# Altium project LimeSDR-USB_1v4.PrjPcb (part 6 of 8)

## Sheet 11_DDR2.SchDoc: RAM DDR2
size A3; Organization: Lime Microsystems; Address1: Surrey Tech Centre; Address2: Guildford GU2 7YG; Address3: Surray; Address4: United Kingdom; Revision: v1.4; SheetNumber: 11; SheetTotal: 15
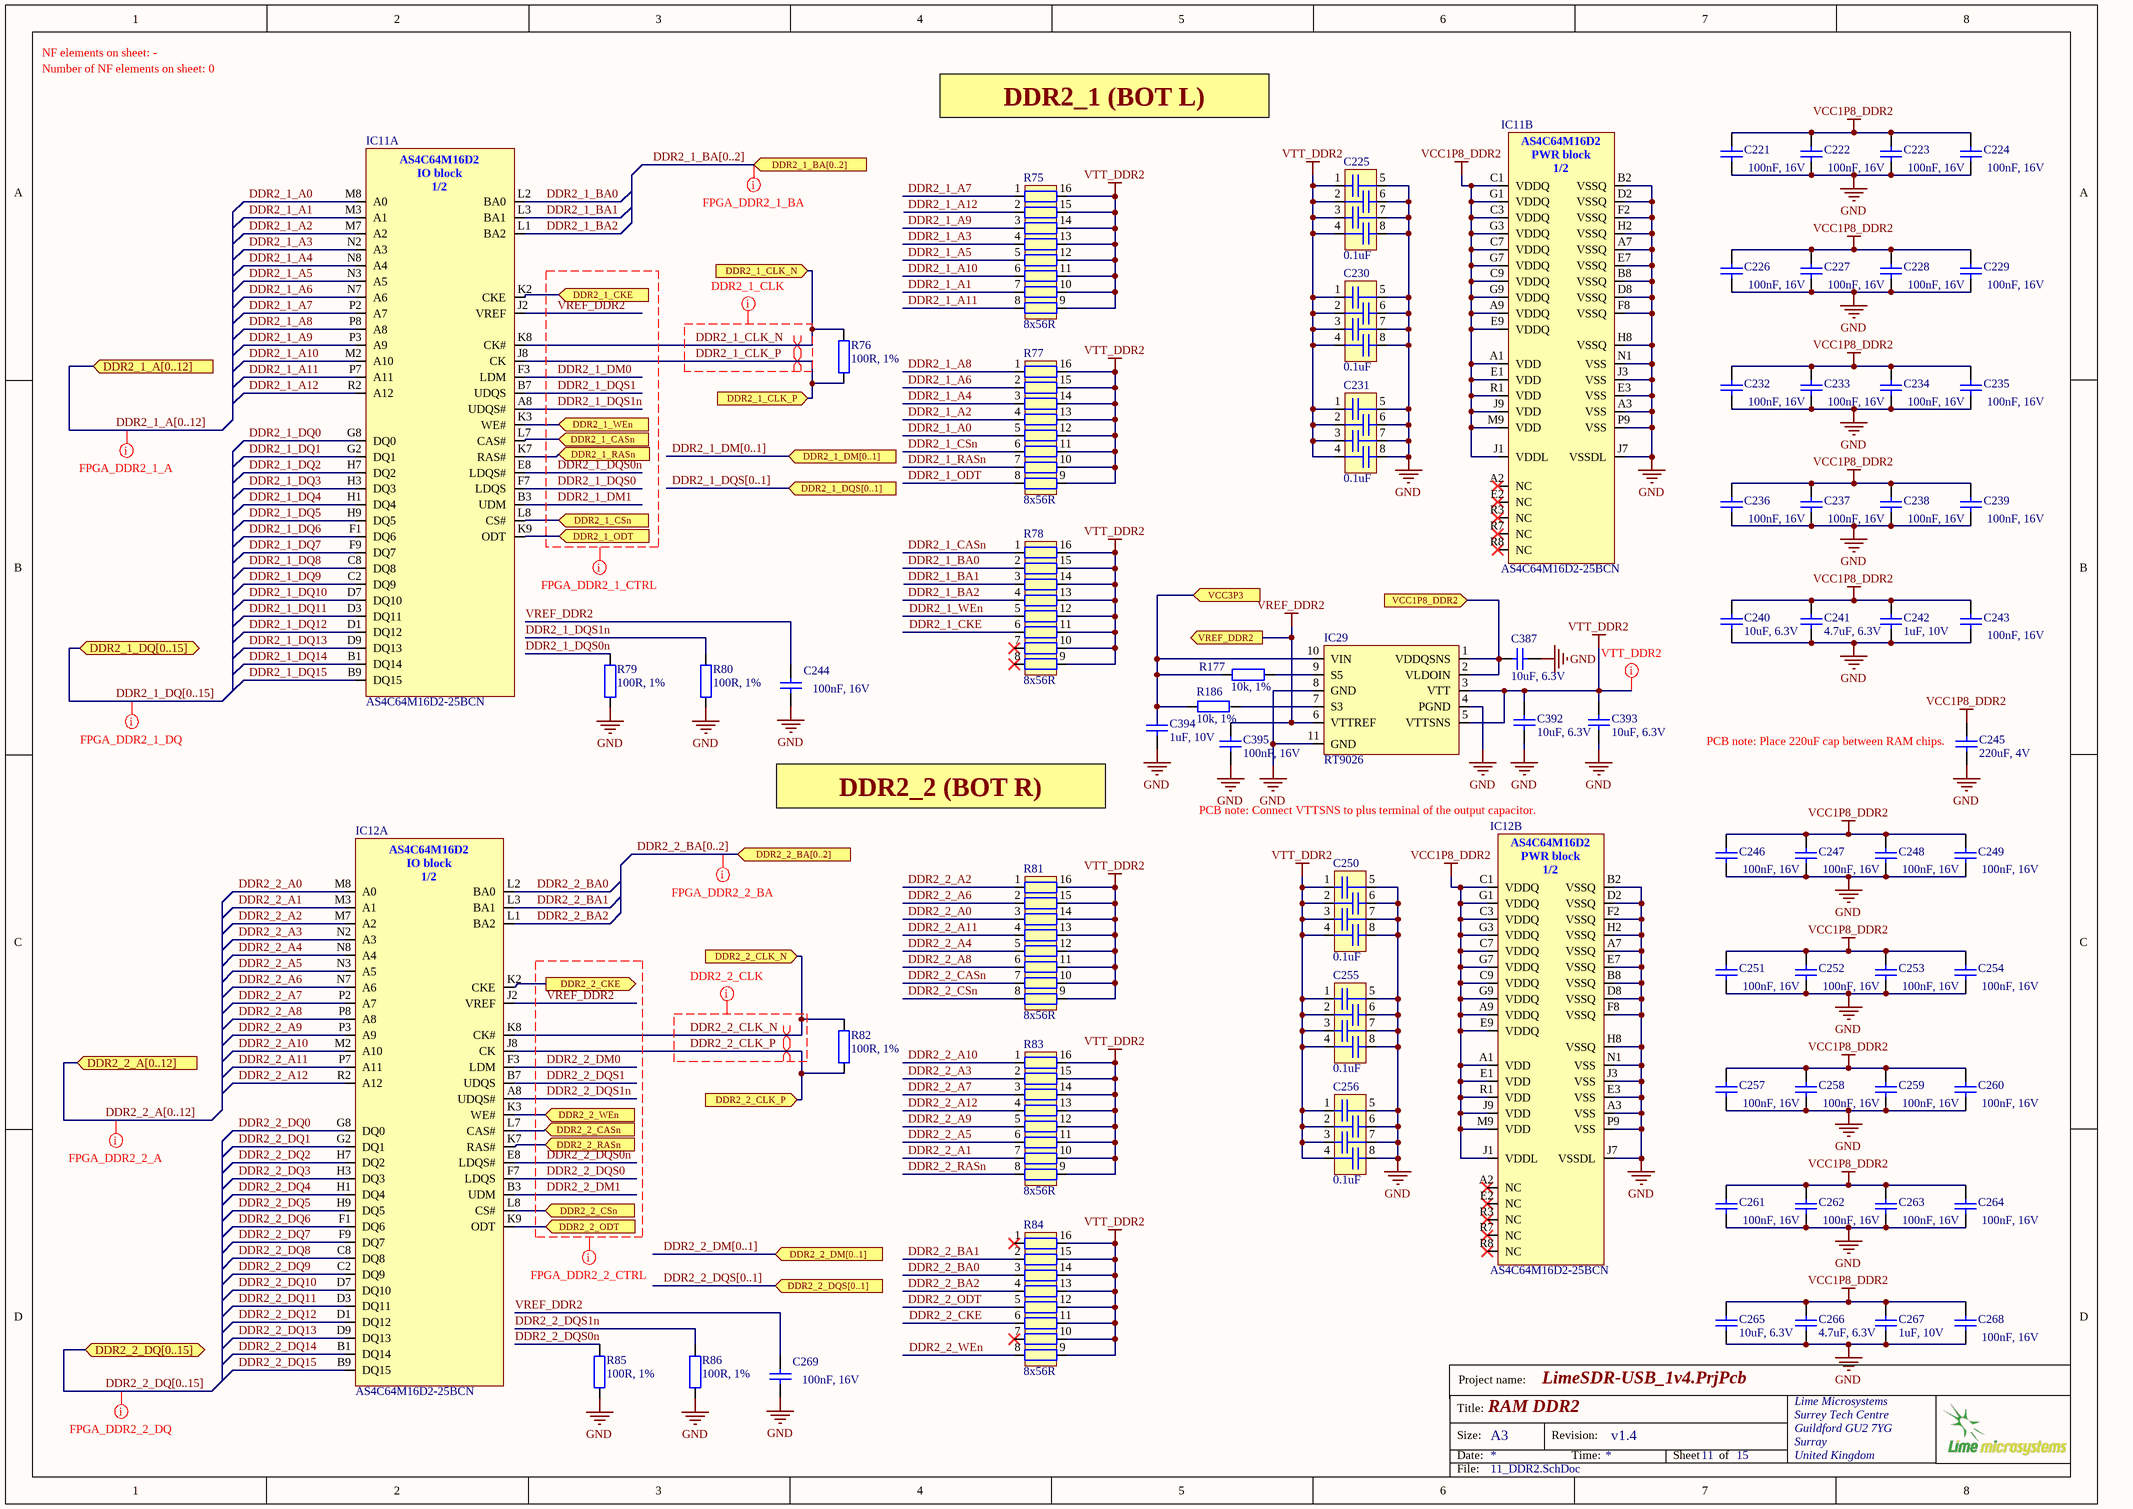
[diagram p10: 11_DDR2.SchDoc]

### Parts
C221  100nF, 16V  [CAP0402]
C222  100nF, 16V  [CAP0402]
C223  100nF, 16V  [CAP0402]
C224  100nF, 16V  [CAP0402]
C225  0.1uF  [CKCA43X7R1C104M100AA]
C226  100nF, 16V  [CAP0402]
C227  100nF, 16V  [CAP0402]
C228  100nF, 16V  [CAP0402]
C229  100nF, 16V  [CAP0402]
C230  0.1uF  [CKCA43X7R1C104M100AA]
C231  0.1uF  [CKCA43X7R1C104M100AA]
C232  100nF, 16V  [CAP0402]
C233  100nF, 16V  [CAP0402]
C234  100nF, 16V  [CAP0402]
C235  100nF, 16V  [CAP0402]
C236  100nF, 16V  [CAP0402]
C237  100nF, 16V  [CAP0402]
C238  100nF, 16V  [CAP0402]
C239  100nF, 16V  [CAP0402]
C240  10uF, 6.3V  [CAP0603]
C241  4.7uF, 6.3V  [CAP0402]
C242  1uF, 10V  [CAP0402]
C243  100nF, 16V  [CAP0402]
C244  100nF, 16V  [CAP0402]
C245  220uF, 4V  [CAP1206]
C246  100nF, 16V  [CAP0402]
C247  100nF, 16V  [CAP0402]
C248  100nF, 16V  [CAP0402]
C249  100nF, 16V  [CAP0402]
C250  0.1uF  [CKCA43X7R1C104M100AA]
C251  100nF, 16V  [CAP0402]
C252  100nF, 16V  [CAP0402]
C253  100nF, 16V  [CAP0402]
C254  100nF, 16V  [CAP0402]
C255  0.1uF  [CKCA43X7R1C104M100AA]
C256  0.1uF  [CKCA43X7R1C104M100AA]
C257  100nF, 16V  [CAP0402]
C258  100nF, 16V  [CAP0402]
C259  100nF, 16V  [CAP0402]
C260  100nF, 16V  [CAP0402]
C261  100nF, 16V  [CAP0402]
C262  100nF, 16V  [CAP0402]
C263  100nF, 16V  [CAP0402]
C264  100nF, 16V  [CAP0402]
C265  10uF, 6.3V  [CAP0603]
C266  4.7uF, 6.3V  [CAP0402]
C267  1uF, 10V  [CAP0402]
C268  100nF, 16V  [CAP0402]
C269  100nF, 16V  [CAP0402]
C387  10uF, 6.3V  [CAP0603]
C392  10uF, 6.3V  [CAP0603]
C393  10uF, 6.3V  [CAP0603]
C394  1uF, 10V  [CAP0402]
C395  100nF, 16V  [CAP0402]
IC11  AS4C64M16D2-25BCN  [AS4C64M16D2]  (parts A,B of 2)
IC12  AS4C64M16D2-25BCN  [AS4C64M16D2]  (parts A,B of 2)
IC29  RT9026  [MSOP10]
R75  8x56R  [EXB2HV]
R76  100R, 1%  [RES0402]
R77  8x56R  [EXB2HV]
R78  8x56R  [EXB2HV]
R79  100R, 1%  [RES0402]
R80  100R, 1%  [RES0402]
R81  8x56R  [EXB2HV]
R82  100R, 1%  [RES0402]
R83  8x56R  [EXB2HV]
R84  8x56R  [EXB2HV]
R85  100R, 1%  [RES0402]
R86  100R, 1%  [RES0402]
R177  10k, 1%  [RES0402]
R186  10k, 1%  [RES0402]

### Ports
DDR2_1_A[0..12] (in), DDR2_1_BA[0..2] (in), DDR2_1_CASn (in), DDR2_1_CKE (in), DDR2_1_CLK_N (in), DDR2_1_CLK_P (in), DDR2_1_CSn (in), DDR2_1_DM[0..1] (in), DDR2_1_DQ[0..15] (bidir), DDR2_1_DQS[0..1] (in), DDR2_1_ODT (in), DDR2_1_RASn (in), DDR2_1_WEn (in), DDR2_2_A[0..12] (in), DDR2_2_BA[0..2] (in), DDR2_2_CASn (in), DDR2_2_CKE (out), DDR2_2_CLK_N (in), DDR2_2_CLK_P (in), DDR2_2_CSn (in), DDR2_2_DM[0..1] (in), DDR2_2_DQ[0..15] (bidir), DDR2_2_DQS[0..1] (in), DDR2_2_ODT (in), DDR2_2_RASn (in), DDR2_2_WEn (in), VCC1P8_DDR2 (in), VCC3P3 (in), VREF_DDR2 (out)

### Nets
GND: C221.2 C222.2 C223.2 C224.2 C225.5 C225.6 C225.7 C225.8 C226.2 C227.2 C228.2 C229.2 C230.5 C230.6 C230.7 C230.8 C231.5 C231.6 C231.7 C231.8 C232.2 C233.2 C234.2 C235.2 C236.2 C237.2 C238.2 C239.2 C240.1 C241.1 C242.1 C243.2 C244.2 C245.1 C246.2 C247.2 C248.2 C249.2 C250.5 C250.6 C250.7 C250.8 C251.2 C252.2 C253.2 C254.2 C255.5 C255.6 C255.7 C255.8 C256.5 C256.6 C256.7 C256.8 C257.2 C258.2 C259.2 C260.2 C261.2 C262.2 C263.2 C264.2 C265.1 C266.1 C267.1 C268.2 C269.2 C387.1 C392.1 C393.1 C394.1 C395.2 IC11.A3(VSS) IC11.A7(VSSQ) IC11.B2(VSSQ) IC11.B8(VSSQ) IC11.D2(VSSQ) IC11.D8(VSSQ) IC11.E3(VSS) IC11.E7(VSSQ) IC11.F2(VSSQ) IC11.F8(VSSQ) IC11.H2(VSSQ) IC11.H8(VSSQ) IC11.J3(VSS) IC11.J7(VSSDL) IC11.N1(VSS) IC11.P9(VSS) IC12.A3(VSS) IC12.A7(VSSQ) IC12.B2(VSSQ) IC12.B8(VSSQ) IC12.D2(VSSQ) IC12.D8(VSSQ) IC12.E3(VSS) IC12.E7(VSSQ) IC12.F2(VSSQ) IC12.F8(VSSQ) IC12.H2(VSSQ) IC12.H8(VSSQ) IC12.J3(VSS) IC12.J7(VSSDL) IC12.N1(VSS) IC12.P9(VSS) IC29.4(PGND) IC29.8(GND) IC29.11(GND) R79.1 R80.1 R85.1 R86.1
VCC1P8_DDR2: C221.1 C222.1 C223.1 C224.1 C226.1 C227.1 C228.1 C229.1 C232.1 C233.1 C234.1 C235.1 C236.1 C237.1 C238.1 C239.1 C240.2 C241.2 C242.2 C243.1 C245.2 C246.1 C247.1 C248.1 C249.1 C251.1 C252.1 C253.1 C254.1 C257.1 C258.1 C259.1 C260.1 C261.1 C262.1 C263.1 C264.1 C265.2 C266.2 C267.2 C268.1 IC11.A1(VDD) IC11.A9(VDDQ) IC11.C1(VDDQ) IC11.C3(VDDQ) IC11.C7(VDDQ) IC11.C9(VDDQ) IC11.E1(VDD) IC11.E9(VDDQ) IC11.G1(VDDQ) IC11.G3(VDDQ) IC11.G7(VDDQ) IC11.G9(VDDQ) IC11.J1(VDDL) IC11.J9(VDD) IC11.M9(VDD) IC11.R1(VDD) IC12.A1(VDD) IC12.A9(VDDQ) IC12.C1(VDDQ) IC12.C3(VDDQ) IC12.C7(VDDQ) IC12.C9(VDDQ) IC12.E1(VDD) IC12.E9(VDDQ) IC12.G1(VDDQ) IC12.G3(VDDQ) IC12.G7(VDDQ) IC12.G9(VDDQ) IC12.J1(VDDL) IC12.J9(VDD) IC12.M9(VDD) IC12.R1(VDD)
VCC_P3: C394.2 IC29.10(VIN) R177.1 R186.1 ; port VCC3P3
VREF_DDR2: C244.1 C269.1 C395.1 IC11.J2(VREF) IC12.J2(VREF) IC29.6(VTTREF) ; port VREF_DDR2
VTT_DDR2: C225.1 C225.2 C225.3 C225.4 C230.1 C230.2 C230.3 C230.4 C231.1 C231.2 C231.3 C231.4 C250.1 C250.2 C250.3 C250.4 C255.1 C255.2 C255.3 C255.4 C256.1 C256.2 C256.3 C256.4 C392.2 C393.2 IC29.3(VTT) IC29.5(VTTSNS) R75.9 R75.10 R75.11 R75.12 R75.13 R75.14 R75.15 R75.16 R77.9 R77.10 R77.11 R77.12 R77.13 R77.14 R77.15 R77.16 R78.9 R78.10 R78.11 R78.12 R78.13 R78.14 R78.15 R78.16 R81.9 R81.10 R81.11 R81.12 R81.13 R81.14 R81.15 R81.16 R83.9 R83.10 R83.11 R83.12 R83.13 R83.14 R83.15 R83.16 R84.9 R84.10 R84.11 R84.12 R84.13 R84.14 R84.15 R84.16
DDR2_1_A0: IC11.M8(A0) R77.5
DDR2_1_A1: IC11.M3(A1) R75.7
DDR2_1_A2: IC11.M7(A2) R77.4
DDR2_1_A3: IC11.N2(A3) R75.4
DDR2_1_A4: IC11.N8(A4) R77.3
DDR2_1_A5: IC11.N3(A5) R75.5
DDR2_1_A6: IC11.N7(A6) R77.2
DDR2_1_A7: IC11.P2(A7) R75.1
DDR2_1_A8: IC11.P8(A8) R77.1
DDR2_1_A9: IC11.P3(A9) R75.3
DDR2_1_A10: IC11.M2(A10) R75.6
DDR2_1_A11: IC11.P7(A11) R75.8
DDR2_1_A12: IC11.R2(A12) R75.2
DDR2_1_BA0: IC11.L2(BA0) R78.2
DDR2_1_BA1: IC11.L3(BA1) R78.3
DDR2_1_BA2: IC11.L1(BA2) R78.4
DDR2_1_CASn: R78.1
DDR2_1_CKE: R78.6
DDR2_1_CLK_N: IC11.K8(CK#) R76.2 ; port DDR2_1_CLK_N
DDR2_1_CLK_P: IC11.J8(CK) R76.1 ; port DDR2_1_CLK_P
DDR2_1_CSn: R77.6
DDR2_1_CTL0: IC11.K2(CKE) ; port DDR2_1_CKE
DDR2_1_CTL1: IC11.K9(ODT) ; port DDR2_1_ODT
DDR2_1_CTL2: IC11.K7(RAS#) ; port DDR2_1_RASn
DDR2_1_CTL3: IC11.L7(CAS#) ; port DDR2_1_CASn
DDR2_1_CTL4: IC11.L8(CS#) ; port DDR2_1_CSn
DDR2_1_CTL5: IC11.K3(WE#) ; port DDR2_1_WEn
DDR2_1_DM0: IC11.F3(LDM)
DDR2_1_DM1: IC11.B3(UDM)
DDR2_1_DQ0: IC11.G8(DQ0)
DDR2_1_DQ1: IC11.G2(DQ1)
DDR2_1_DQ2: IC11.H7(DQ2)
DDR2_1_DQ3: IC11.H3(DQ3)
DDR2_1_DQ4: IC11.H1(DQ4)
DDR2_1_DQ5: IC11.H9(DQ5)
DDR2_1_DQ6: IC11.F1(DQ6)
DDR2_1_DQ7: IC11.F9(DQ7)
DDR2_1_DQ8: IC11.C8(DQ8)
DDR2_1_DQ9: IC11.C2(DQ9)
DDR2_1_DQ10: IC11.D7(DQ10)
DDR2_1_DQ11: IC11.D3(DQ11)
DDR2_1_DQ12: IC11.D1(DQ12)
DDR2_1_DQ13: IC11.D9(DQ13)
DDR2_1_DQ14: IC11.B1(DQ14)
DDR2_1_DQ15: IC11.B9(DQ15)
DDR2_1_DQS0: IC11.F7(LDQS)
DDR2_1_DQS0n: IC11.E8(LDQS#) R79.2
DDR2_1_DQS1: IC11.B7(UDQS)
DDR2_1_DQS1n: IC11.A8(UDQS#) R80.2
DDR2_1_ODT: R77.8
DDR2_1_RASn: R77.7
DDR2_1_WEn: R78.5
DDR2_2_A0: IC12.M8(A0) R81.3
DDR2_2_A1: IC12.M3(A1) R83.7
DDR2_2_A2: IC12.M7(A2) R81.1
DDR2_2_A3: IC12.N2(A3) R83.2
DDR2_2_A4: IC12.N8(A4) R81.5
DDR2_2_A5: IC12.N3(A5) R83.6
DDR2_2_A6: IC12.N7(A6) R81.2
DDR2_2_A7: IC12.P2(A7) R83.3
DDR2_2_A8: IC12.P8(A8) R81.6
DDR2_2_A9: IC12.P3(A9) R83.5
DDR2_2_A10: IC12.M2(A10) R83.1
DDR2_2_A11: IC12.P7(A11) R81.4
DDR2_2_A12: IC12.R2(A12) R83.4
DDR2_2_BA0: IC12.L2(BA0) R84.3
DDR2_2_BA1: IC12.L3(BA1) R84.2
DDR2_2_BA2: IC12.L1(BA2) R84.4
DDR2_2_CASn: R81.7
DDR2_2_CKE: R84.6
DDR2_2_CLK_N: IC12.K8(CK#) R82.2 ; port DDR2_2_CLK_N
DDR2_2_CLK_P: IC12.J8(CK) R82.1 ; port DDR2_2_CLK_P
DDR2_2_CSn: R81.8
DDR2_2_CTL0: IC12.K2(CKE) ; port DDR2_2_CKE
DDR2_2_CTL1: IC12.K9(ODT) ; port DDR2_2_ODT
DDR2_2_CTL2: IC12.K7(RAS#) ; port DDR2_2_RASn
DDR2_2_CTL3: IC12.L7(CAS#) ; port DDR2_2_CASn
DDR2_2_CTL4: IC12.L8(CS#) ; port DDR2_2_CSn
DDR2_2_CTL5: IC12.K3(WE#) ; port DDR2_2_WEn
DDR2_2_DM0: IC12.F3(LDM)
DDR2_2_DM1: IC12.B3(UDM)
DDR2_2_DQ0: IC12.G8(DQ0)
DDR2_2_DQ1: IC12.G2(DQ1)
DDR2_2_DQ2: IC12.H7(DQ2)
DDR2_2_DQ3: IC12.H3(DQ3)
DDR2_2_DQ4: IC12.H1(DQ4)
DDR2_2_DQ5: IC12.H9(DQ5)
DDR2_2_DQ6: IC12.F1(DQ6)
DDR2_2_DQ7: IC12.F9(DQ7)
DDR2_2_DQ8: IC12.C8(DQ8)
DDR2_2_DQ9: IC12.C2(DQ9)
DDR2_2_DQ10: IC12.D7(DQ10)
DDR2_2_DQ11: IC12.D3(DQ11)
DDR2_2_DQ12: IC12.D1(DQ12)
DDR2_2_DQ13: IC12.D9(DQ13)
DDR2_2_DQ14: IC12.B1(DQ14)
DDR2_2_DQ15: IC12.B9(DQ15)
DDR2_2_DQS0: IC12.F7(LDQS)
DDR2_2_DQS0n: IC12.E8(LDQS#) R85.2
DDR2_2_DQS1: IC12.B7(UDQS)
DDR2_2_DQS1n: IC12.A8(UDQS#) R86.2
DDR2_2_ODT: R84.5
DDR2_2_RASn: R83.8
DDR2_2_WEn: R84.8
VCC_P4: C387.2 IC29.1(VDDQSNS) IC29.2(VLDOIN) ; port VCC1P8_DDR2
NetIC29_7: IC29.7(S3) R186.2
NetIC29_9: IC29.9(S5) R177.2

Not connected (* = marked no-connect by the designer): IC11 A2(NC)* E2(NC)* R3(NC)* R7(NC)* R8(NC)*; IC12 A2(NC)* E2(NC)* R3(NC)* R7(NC)* R8(NC)*; R78 7* 8*; R84 1* 7*

### Buses and harness runs
bus DDR2_1_A[0..12] = port DDR2_1_A[0..12]
bus DDR2_1_BA[0..2] = port DDR2_1_BA[0..2]
bus DDR2_1_DM[0..1] = port DDR2_1_DM[0..1]
bus DDR2_1_DQ[0..15] = port DDR2_1_DQ[0..15]
bus DDR2_1_DQS[0..1] = port DDR2_1_DQS[0..1]
bus DDR2_2_A[0..12] = port DDR2_2_A[0..12]
bus DDR2_2_BA[0..2] = port DDR2_2_BA[0..2]
bus DDR2_2_DM[0..1] = port DDR2_2_DM[0..1]
bus DDR2_2_DQ[0..15] = port DDR2_2_DQ[0..15]
bus DDR2_2_DQS[0..1] = port DDR2_2_DQS[0..1]

### Layout directives
net class FPGA_DDR0_DQ: (no net found under the mark)
net class FPGA_DDR0_BA: (no net found under the mark)
net class FPGA_DDR0_CTRL: DDR2_1_DM0, DDR2_1_DM1, DDR2_1_DQS0, DDR2_1_DQS0n, DDR2_1_DQS1, DDR2_1_DQS1n, VREF_DDR2
net class FPGA_DDR0_A: (no net found under the mark)
net class FPGA_DDR1_DQ: (no net found under the mark)
net class FPGA_DDR1_BA: (no net found under the mark)
net class FPGA_DDR1_CTRL: DDR2_2_DM0, DDR2_2_DM1, DDR2_2_DQS0, DDR2_2_DQS0n, DDR2_2_DQS1, DDR2_2_DQS1n, VREF_DDR2
net class FPGA_DDR1_A: (no net found under the mark)
differential pair: DDR2_1_CLK_N, DDR2_1_CLK_P, DDR2_2_CLK_N, DDR2_2_CLK_P
net class DDR2_1_CK: DDR2_1_CLK_N, DDR2_1_CLK_P, DDR2_2_CLK_N, DDR2_2_CLK_P
net class VTT_DDR2: VTT_DDR2

### Notes on the sheet
- Number of NF elements on sheet: 0
- NF elements on sheet: -
- DDR2_1 (BOT L)
- (near C245) PCB note: Place 220uF cap between RAM chips.
- DDR2_2 (BOT R)
- PCB note: Connect VTTSNS to plus terminal of the output capacitor.
- Project name:
- Title:
- Size:
- Date:
- A3
- Revision:
- Time:
- Sheet
- of
- File:
- (in symbol AS4C64M16D2-25BCN, part A) AS4C64M16D2 / IO block / 1/2
- (in symbol AS4C64M16D2-25BCN, part B) AS4C64M16D2 / PWR block / 1/2

### Library data of the parts
C221-C224 C226-C229 C232-C239 C243 C244 C246-C249 C251-C254 C257-C264 C268 C269 = Cap_0603: as C103-C114 on sheet 08_FPGA_banks_1_2_3_4; Supplier 1: Mouser; Supplier Part Number 1: 81-GRM155R71C104KA88; Case Code - in: 0402; Manufacturer: Murata Electronics; Category: Multilayer Ceramic Capacitors MLCC - SMD/SMT; Voltage Rating DC: 16 V; Value: 100nF, 16V; Manufacturer Part Number: GRM155R71C104KA88D
C225 C230 C231 C250 C255 C256 = 4X_cap_array_1206: Manufacturer: TDK; Part Description: CAP ARRAY 0.1UF 16V X7R 1206; Case Height: 1 mm; Case Length: 3.2 mm; Case Width: 1.6 mm; Voltage Rating: 16 V; Number of Elements: 4; Tolerance: 20 %; Temperature Coefficient / Code: X7R; Value: 0.1uF; Supplier 1: Mouser; Supplier Part Number 1: 810-CKCA43X7R1C104M; RoHS: RoHS Compliant; Termination Style: SMD/SMT; Brand: TDK; Category: Capacitor Arrays & Networks; Product: Ceramic Capacitor Arrays; Series: CKC; Packaging: Reel; Operating Temperature Range: - 55 C to + 125 C; Manufacturer Part Number 1: CKCA43X7R1C104M100AA; Capacitance: 0.1 uF; Product Category: Capacitor Arrays; Standard Pack Qty: 2000; RoHS - Mouser: Y; Minimum Order Quantity: 1; Reeling: True
C240 C265 C387 C392 C393 = Cap_0603: as C116 on sheet 10_FPGA_misc; Supplier 1: Digi-Key; Supplier Part Number 1: 311-1448-2-ND; Package / Case: 0603 (1608 Metric); Category: Capacitors; Voltage - Rated: 6.3V; Value: 10uF, 6.3V
C241 C266 = Cap_0402: as C117 on sheet 10_FPGA_misc; Lead Style: -; Ratings: -; Height - Seated (Max): -; Thickness (Max): 0.022" (0.55mm); Voltage - Rated: 6.3V; Packaging: Cut Tape (CT); Lead Spacing: -; Category: Capacitors; Supplier Part Number 1: 490-5408-1-ND; Applications: General Purpose; Operating Temperature: -55°C ~ 85°C; Mounting Type: Surface Mount, MLCC; Features: Derating Recommended; RoHS: RoHS Compliant; Supplier 1: Digi-Key; Package / Case: 0402 (1005 Metric); Size / Dimension: 0.039" L x 0.020" W (1.00mm x 0.50mm); Value: 4.7uF, 6.3V
C242 C267 C394 = Cap_0402: as C118 on sheet 10_FPGA_misc; Value: 1uF, 10V; Supplier 1: Newark; Supplier Part Number 1: 490-6298-2-ND; MSL: -; RoHS: YES
C245 = Cap_1206: as C115 on sheet 10_FPGA_misc; Package / Case: 1206 (3216 Metric); Supplier 1: Digi-Key; Packaging: Cut Tape (CT); Size / Dimension: 0.126" L x 0.063" W (3.20mm x 1.60mm); Operating Temperature: -55°C ~ 85°C; Voltage - Rated: 4V; Mounting Type: Surface Mount, MLCC; Ratings: -; Supplier Part Number 1: 490-9774-1-ND; Category: Capacitors; Lead Spacing: -; Lead Style: -; Applications: General Purpose; Features: -; Height - Seated (Max): -; Thickness (Max): 0.075" (1.90mm); RoHS: RoHS Compliant; Value: 220uF, 4V; Manufacturer Part Number 1: GRM31CR60G227ME11L
C395 = Cap_0402: Manufacturer: Murata Electronics; Manufacturer Part Number: GRM155R71C104KA88D; Part Description: 0.10µF ±10% 16V X7R Ceramic Capacitor -55°C ~ 125°C Surface Mount, MLCC 0402 (1005 Metric) 0.039" L x 0.020" W (1.00mm x 0.50mm); Tolerance: 10 %; Type: General Purpose MLCC; Capacitance: 0.1 uF; Case Length: 1 mm; Dielectric: X7R; Case Height: 0.5 mm; Temperature Coefficient / Code: +/- 15 %; Value: 100nF, 16V; Supplier 1: Mouser; Supplier Part Number 1: 81-GRM155R71C104KA88; Case Code - in: 0402; RoHS: RoHS Compliant; Operating Temperature Range: - 55 C to + 125 C; Series: GRM; Termination Style: SMD/SMT; Package / Case: 0402 (1005 metric); Voltage Rating DC: 16 V; Maximum Operating Temperature: + 125 C; Case Code - mm: 1005; Minimum Operating Temperature: - 55 C; Product Category: Low & Medium Capacitance SMD Ceramic Chip Capacitors; Packaging: Reel; Product: General Type MLCCs; Category: Multilayer Ceramic Capacitors MLCC - SMD/SMT; Brand: Murata Electronics; Case Width: 0.5 mm; RoHS - Mouser: Y; Standard Pack Qty: 10000; Minimum Order Quantity: 1; Reeling: True; Manufacturer Part Number 1: GRM155R71C104KA88D
IC11 IC12 = AS4C64M16D2-25BCN: Manufacturer: Alliance Memory, Inc.; Part Description: IC SDRAM 64MX16 1.8V 84-FBGA; Speed: 400MHz; Interface: Parallel; Memory Type: DDR2 SDRAM; Memory Size: 1G (64M x 16); Voltage - Supply: 1.7 V ~ 1.9 V; Format - Memory: RAM; Supplier 1: Digi-Key; Package / Case: 84-TFBGA; Supplier Device Package: 84-FBGA (8x12.5); Manufacturer Part Number 1: AS4C64M16D2-25BCN; RoHS: RoHS Compliant; Operating Temperature: 0°C ~ 70°C; Category: Integrated Circuits (ICs); Packaging: Tray; Supplier Part Number 1: 1450-1158-ND
IC29 = RT9026: Manufacturer Part Number 1: RT9026GFP; Manufacturer: Richtek USA Inc.; Part Description: IC DDR TERMINATION REG 10MSOP; Number of Outputs: 1; Voltage - Input: 3.15 V ~ 5.5 V; Supplier 1: Digi-Key; Supplier Part Number 1: 1028-1010-1-ND; Supplier Device Package: 10-MSOP-EP; Operating Temperature: -40°C ~ 85°C; Applications: Converter, DDR Bus Termination Regulator; RoHS: RoHS Compliant; Packaging: Cut Tape (CT); Mounting Type: Surface Mount; Package / Case: 10-TFSOP, 10-MSOP (0.118", 3.00mm Width) Exposed Pad; Category: Integrated Circuits (ICs)
R75 R77 R78 R81 R83 R84 = 8X_resistor_array_0402: Manufacturer Part Number 1: EXB2HV560JV; Manufacturer: PANASONIC ELECTRONIC COMPONENTS; Part Description: RES ARRAY 8 RES 56 OHM 1506; Supplier 1: Farnell; Supplier Part Number 1: 2060070; RoHS: YES
R76 R79 R80 R82 R85 R86 = Res_0402: Manufacturer Part Number 1: RMCF0402FT100R; Part Description: RES SMD 100 OHM 1% 1/16W 0402; Manufacturer: Stackpole Electronics Inc.; Temperature Coefficient: ±100ppm/°C; Supplier 1: Digi-Key; Supplier Part Number 1: RMCF0402FT100RDKR-ND; Package / Case: 0402 (1005 Metric); Composition: Thick Film; Category: Resistors; Tolerance: ±1%; Value: 100R, 1%
R177 R186 = Res_0402: as R55 on sheet 10_FPGA_misc; Value: 10k, 1%; Supplier 1: Digi-Key; Supplier Part Number 1: 311-10.0KLRTR-ND; Resistance (Ohms): 10k; Packaging: Tape & Reel (TR); RoHS: RoHS Compliant; Package / Case: 0402 (1005 Metric); Tolerance: ±1%; Operating Temperature: -55°C ~ 155°C; Size / Dimension: 0.039" L x 0.020" W (1.00mm x 0.50mm); Number of Terminations: 2; Category: Resistors; Height: 0.016" (0.40mm); Supplier Device Package: 0402; Features: Moisture Resistant; Composition: Thick Film

## Sheet LMS7002M.SchDoc: LMS7002M Sheet Symbol Connections
size A3; Author: NeoExiZ; CompanyName: BUPT CPS Lab; Engineer: NeoExiZ; Organization: NeoExiZ; Address1: 418, 4#Building,BUPT; Address2: No.10, Xitucheng Road; Address3: Beijing; Address4: China
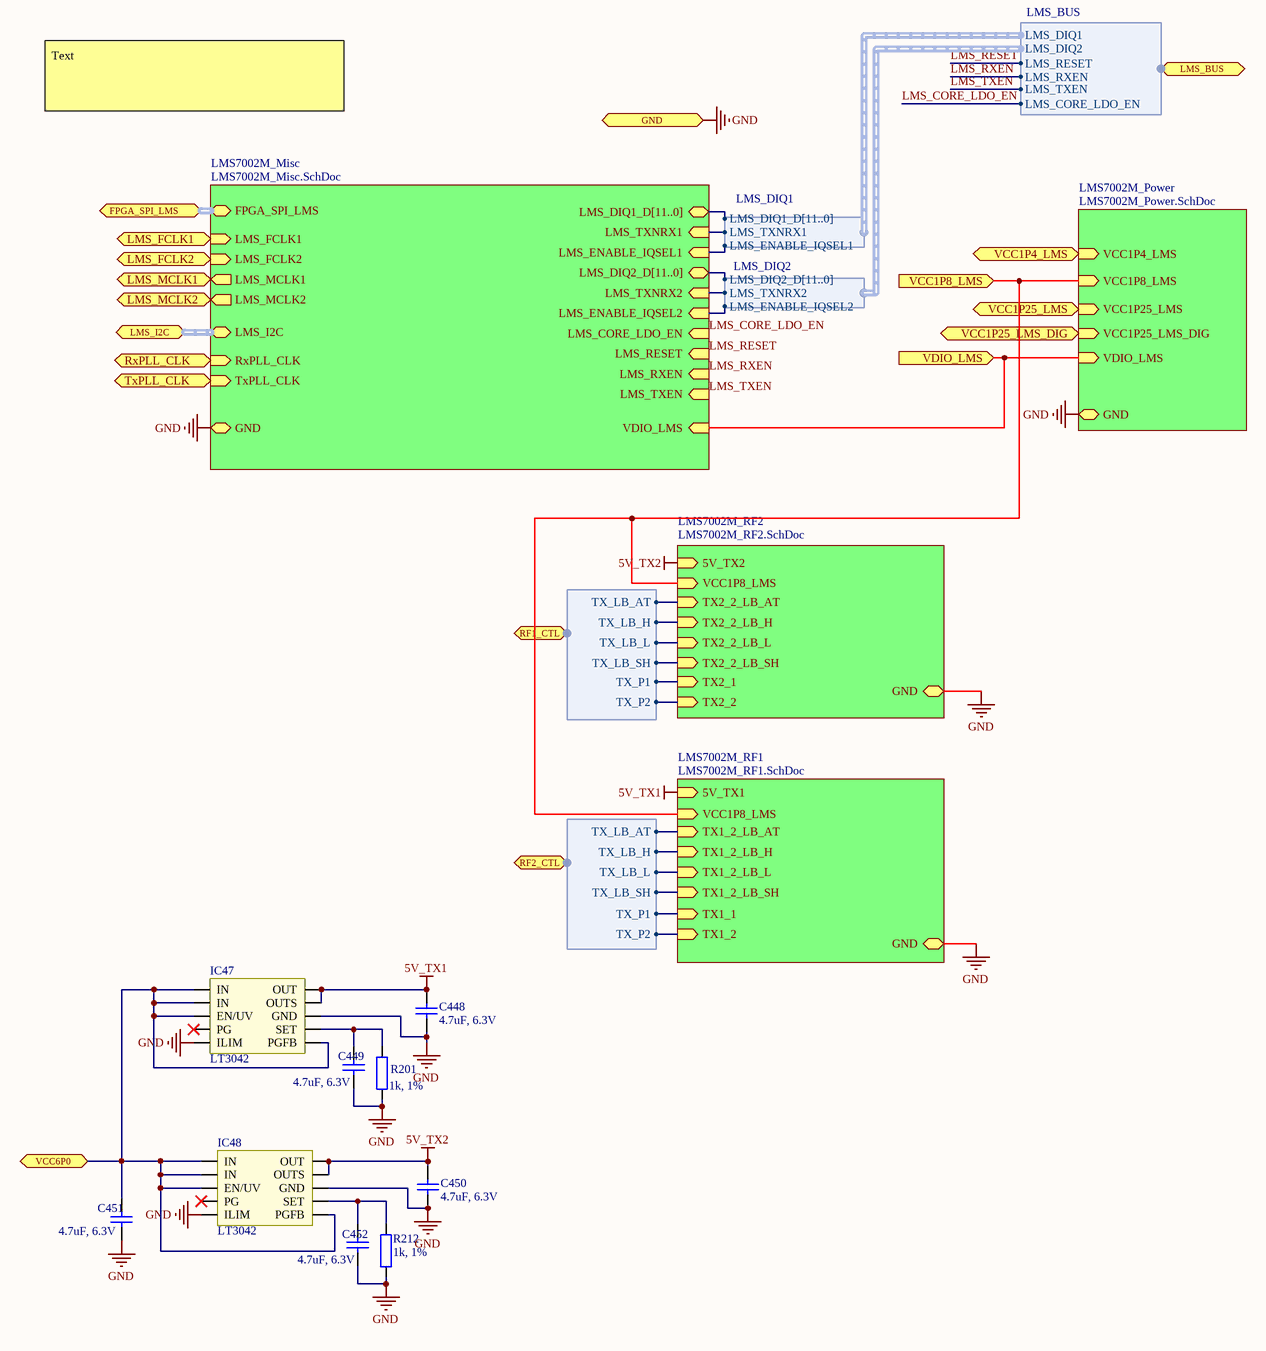
[diagram p11: LMS7002M.SchDoc]

### Parts
C448  4.7uF, 6.3V  [CAP0402]
C449  4.7uF, 6.3V  [CAP0402]
C450  4.7uF, 6.3V  [CAP0402]
C451  4.7uF, 6.3V  [CAP0402]
C452  4.7uF, 6.3V  [CAP0402]
IC47  LT3042  [SOP-10]
IC48  LT3042  [SOP-10]
R201  1k, 1%  [RES0402]
R212  1k, 1%  [RES0402]

### Sub-sheets
LMS7002M_Misc = LMS7002M_Misc.SchDoc: FPGA_SPI_LMS (harness FPGA_SPI_LMS), LMS_FCLK1 (in), LMS_FCLK2 (in), LMS_MCLK1 (out), LMS_MCLK2 (out), RxPLL_CLK (in), TxPLL_CLK (in), LMS_DIQ2_D[11..0] (bidir), LMS_DIQ1_D[11..0] (bidir), LMS_ENABLE_IQSEL1 (in), LMS_ENABLE_IQSEL2 (in), LMS_TXNRX1 (in), LMS_TXNRX2 (in), LMS_CORE_LDO_EN (in), LMS_RESET (in), LMS_RXEN (in), LMS_TXEN (in), VDIO_LMS (in), GND, LMS_I2C (harness I2C)
LMS7002M_Power = LMS7002M_Power.SchDoc (file not in this document): VCC1P4_LMS (in), VCC1P8_LMS (in), VCC1P25_LMS (in), VCC1P25_LMS_DIG (in), VDIO_LMS (in), GND
LMS7002M_RF1 = LMS7002M_RF1.SchDoc: TX1_2_LB_AT (in), TX1_2_LB_H (in), TX1_2_LB_L (in), TX1_2_LB_SH (in), VCC1P8_LMS (in), GND, TX1_2 (in), TX1_1 (in), 5V_TX1 (in)
LMS7002M_RF2 = LMS7002M_RF2.SchDoc: TX2_2_LB_SH (in), TX2_2_LB_L (in), TX2_2_LB_H (in), TX2_2_LB_AT (in), VCC1P8_LMS (in), GND, TX2_1 (in), TX2_2 (in), 5V_TX2 (in)

### Ports
FPGA_SPI_LMS (harness FPGA_SPI_LMS), GND, LMS_BUS (harness LMS_BUS), LMS_FCLK1 (in), LMS_FCLK2 (in), LMS_I2C (harness I2C), LMS_MCLK1 (out), LMS_MCLK2 (out), RF1_CTL (harness RF_CTL), RF2_CTL (harness RF_CTL), RxPLL_CLK (in), TxPLL_CLK (in), VCC1P4_LMS (in), VCC1P8_LMS (in), VCC1P25_LMS (in), VCC1P25_LMS_DIG (in), VCC6P0, VDIO_LMS (in)

### Harnesses
LMS_BUS: LMS_DIQ1, LMS_DIQ2, LMS_RESET, LMS_RXEN, LMS_TXEN, LMS_CORE_LDO_EN
LMS_DIQ1: LMS_DIQ1_D[11..0], LMS_TXNRX1, LMS_ENABLE_IQSEL1
LMS_DIQ2: LMS_DIQ2_D[11..0], LMS_TXNRX2, LMS_ENABLE_IQSEL2
RF_CTL: TX_LB_AT, TX_LB_H, TX_LB_L, TX_LB_SH, TX_P1, TX_P2

### Nets
5V_TX1: C448.2 IC47.9(OUTS) IC47.10(OUT) ; sheet LMS7002M_RF1/5V_TX1
5V_TX2: C450.2 IC48.9(OUTS) IC48.10(OUT) ; sheet LMS7002M_RF2/5V_TX2
GND: C448.1 C449.1 C450.1 C451.1 C452.1 IC47.5(ILIM) IC47.8(GND) IC48.5(ILIM) IC48.8(GND) R201.1 R212.1 ; port GND, sheet LMS7002M_Misc/GND, sheet LMS7002M_Power/GND, sheet LMS7002M_RF1/GND, sheet LMS7002M_RF2/GND
VCC6P0: C451.2 IC47.1(IN) IC47.2(IN) IC47.3(EN/UV) IC47.6(PGFB) IC48.1(IN) IC48.2(IN) IC48.3(EN/UV) IC48.6(PGFB) ; port VCC6P0
VCC_LMS1: port VCC1P8_LMS, sheet LMS7002M_Power/VCC1P8_LMS, sheet LMS7002M_RF1/VCC1P8_LMS, sheet LMS7002M_RF2/VCC1P8_LMS
VDIO_LMS: port VDIO_LMS, sheet LMS7002M_Misc/VDIO_LMS, sheet LMS7002M_Power/VDIO_LMS
LMS_CORE_LDO_EN: sheet LMS7002M_Misc/LMS_CORE_LDO_EN, port LMS_BUS.LMS_CORE_LDO_EN
LMS_ENABLE_IQSEL1: sheet LMS7002M_Misc/LMS_ENABLE_IQSEL1, harness LMS_DIQ1.LMS_ENABLE_IQSEL1
LMS_ENABLE_IQSEL2: sheet LMS7002M_Misc/LMS_ENABLE_IQSEL2, harness LMS_DIQ2.LMS_ENABLE_IQSEL2
LMS_FCLK1: port LMS_FCLK1, sheet LMS7002M_Misc/LMS_FCLK1
LMS_FCLK2: port LMS_FCLK2, sheet LMS7002M_Misc/LMS_FCLK2
LMS_MCLK1: port LMS_MCLK1, sheet LMS7002M_Misc/LMS_MCLK1
LMS_MCLK2: port LMS_MCLK2, sheet LMS7002M_Misc/LMS_MCLK2
LMS_RESET: sheet LMS7002M_Misc/LMS_RESET, port LMS_BUS.LMS_RESET
LMS_RXEN: sheet LMS7002M_Misc/LMS_RXEN, port LMS_BUS.LMS_RXEN
LMS_TXEN: sheet LMS7002M_Misc/LMS_TXEN, port LMS_BUS.LMS_TXEN
LMS_TXNRX1: sheet LMS7002M_Misc/LMS_TXNRX1, harness LMS_DIQ1.LMS_TXNRX1
LMS_TXNRX2: sheet LMS7002M_Misc/LMS_TXNRX2, harness LMS_DIQ2.LMS_TXNRX2
RxPLL_CLK: port RxPLL_CLK, sheet LMS7002M_Misc/RxPLL_CLK
TX1_2_LB_AT: sheet LMS7002M_RF1/TX1_2_LB_AT, port RF2_CTL.TX_LB_AT
TX1_2_LB_H: sheet LMS7002M_RF1/TX1_2_LB_H, port RF2_CTL.TX_LB_H
TX1_2_LB_L: sheet LMS7002M_RF1/TX1_2_LB_L, port RF2_CTL.TX_LB_L
TX1_2_LB_SH: sheet LMS7002M_RF1/TX1_2_LB_SH, port RF2_CTL.TX_LB_SH
TX2_2_LB_AT: sheet LMS7002M_RF2/TX2_2_LB_AT, port RF1_CTL.TX_LB_AT
TX2_2_LB_H: sheet LMS7002M_RF2/TX2_2_LB_H, port RF1_CTL.TX_LB_H
TX2_2_LB_L: sheet LMS7002M_RF2/TX2_2_LB_L, port RF1_CTL.TX_LB_L
TX2_2_LB_SH: sheet LMS7002M_RF2/TX2_2_LB_SH, port RF1_CTL.TX_LB_SH
TxPLL_CLK: port TxPLL_CLK, sheet LMS7002M_Misc/TxPLL_CLK
VCC_LMS0: port VCC1P4_LMS, sheet LMS7002M_Power/VCC1P4_LMS
VCC_LMS2: port VCC1P25_LMS, sheet LMS7002M_Power/VCC1P25_LMS
VCC_LMS3: port VCC1P25_LMS_DIG, sheet LMS7002M_Power/VCC1P25_LMS_DIG
NetC449_2: C449.2 IC47.7(SET) R201.2
NetC452_2: C452.2 IC48.7(SET) R212.2
NetIC15_4: sheet LMS7002M_RF1/TX1_1, port RF2_CTL.TX_P1
NetIC15_6: sheet LMS7002M_RF1/TX1_2, port RF2_CTL.TX_P2
NetIC42_4: sheet LMS7002M_RF2/TX2_2, port RF1_CTL.TX_P2
NetIC42_6: sheet LMS7002M_RF2/TX2_1, port RF1_CTL.TX_P1

Not connected (* = marked no-connect by the designer): IC47 4(PG)*; IC48 4(PG)*

### Buses and harness runs
harness port FPGA_SPI_LMS = sheet LMS7002M_Misc/FPGA_SPI_LMS
harness port LMS_I2C = sheet LMS7002M_Misc/LMS_I2C

### Notes on the sheet
- Text
- Note:
- Project Name:
- Size:
- Date:
- Title:
- A3
- Revision:
- Time:
- Author:
- Sheet
- of
- File:

### Library data of the parts
C448-C452 = Cap_0402: as C117 on sheet 10_FPGA_misc; Lead Style: -; Ratings: -; Height - Seated (Max): -; Thickness (Max): 0.022" (0.55mm); Voltage - Rated: 6.3V; Packaging: Cut Tape (CT); Lead Spacing: -; Category: Capacitors; Supplier Part Number 1: 490-5408-1-ND; Applications: General Purpose; Operating Temperature: -55°C ~ 85°C; Mounting Type: Surface Mount, MLCC; Features: Derating Recommended; RoHS: RoHS Compliant; Supplier 1: Digi-Key; Package / Case: 0402 (1005 Metric); Size / Dimension: 0.039" L x 0.020" W (1.00mm x 0.50mm); Value: 4.7uF, 6.3V
R201 R212 = Res_0402: as R62 on sheet 10_FPGA_misc; Value: 1k, 1%; Supplier 1: Digi-Key; Supplier Part Number 1: RMCF0402FT1K00TR-ND; Resistance (Ohms): 1k; Packaging: Tape & Reel (TR); Category: Resistors; RoHS: RoHS Compliant; Tolerance: ±1%; Height: 0.016" (0.40mm); Number of Terminations: 2; Package / Case: 0402 (1005 Metric); Operating Temperature: -55°C ~ 155°C; Features: -; Composition: Thick Film; Supplier Device Package: 0402; Size / Dimension: 0.039" L x 0.020" W (1.00mm x 0.50mm)

## Sheet LMS7002M_Misc.SchDoc: LMS7002M misc
size A3; Organization: Lime Microsystems; Address1: Surrey Tech Centre; Address2: Guildford GU2 7YG; Address3: Surrey; Address4: United Kingdom; Revision: v1.4; SheetNumber: 4; SheetTotal: 15
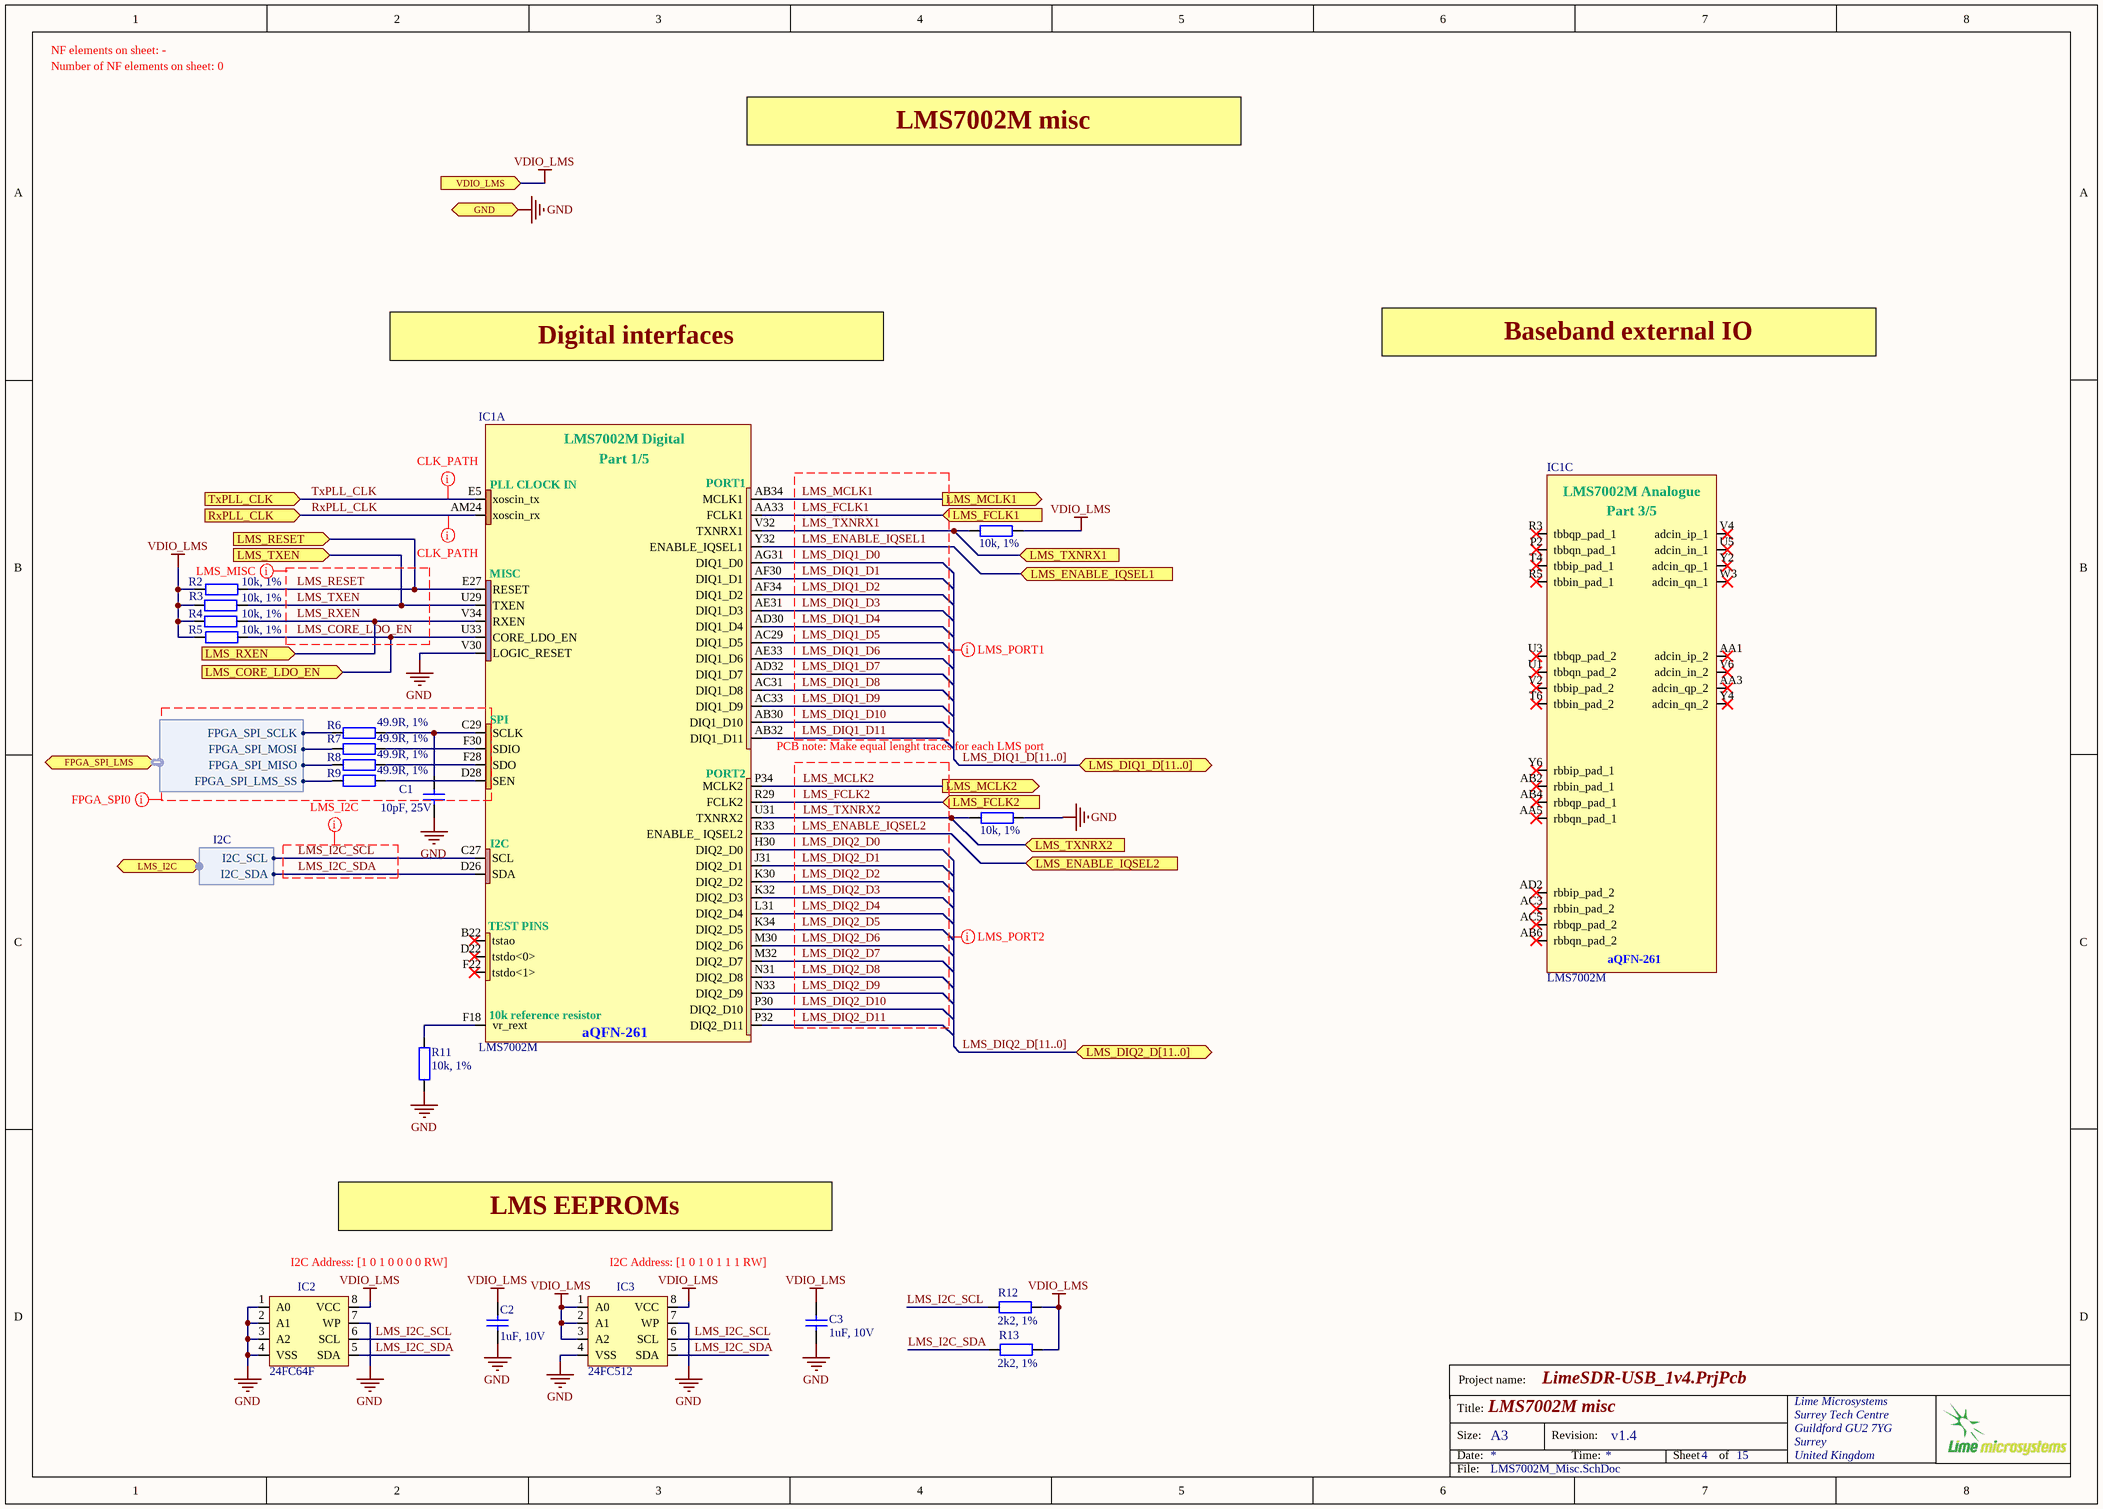
[diagram p12: LMS7002M_Misc.SchDoc]

### Parts
C1  10pF, 25V  [CAP0402]
C2  1uF, 10V  [CAP0402]
C3  1uF, 10V  [CAP0402]
IC1  LMS7002M  [LMS7002M_v3]  (parts A,C of 5)
IC2  24FC64F  [24FC512]
IC3  24FC512  [24FC512]
R1  10k, 1%  [RES0402]
R2  10k, 1%  [RES0402]
R3  10k, 1%  [RES0402]
R4  10k, 1%  [RES0402]
R5  10k, 1%  [RES0402]
R6  49.9R, 1%  [RES0402]
R7  49.9R, 1%  [RES0402]
R8  49.9R, 1%  [RES0402]
R9  49.9R, 1%  [RES0402]
R10  10k, 1%  [RES0402]
R11  10k, 1%  [RES0402]
R12  2k2, 1%  [RES0402]
R13  2k2, 1%  [RES0402]

### Ports
FPGA_SPI_LMS (harness FPGA_SPI_LMS), GND, LMS_CORE_LDO_EN (in), LMS_DIQ1_D[11..0] (bidir), LMS_DIQ2_D[11..0] (bidir), LMS_ENABLE_IQSEL1 (in), LMS_ENABLE_IQSEL2 (in), LMS_FCLK1 (in), LMS_FCLK2 (in), LMS_I2C (harness I2C), LMS_MCLK1 (out), LMS_MCLK2 (out), LMS_RESET (in), LMS_RXEN (in), LMS_TXEN (in), LMS_TXNRX1 (in), LMS_TXNRX2 (in), RxPLL_CLK (in), TxPLL_CLK (in), VDIO_LMS (in)

### Harnesses
FPGA_SPI_LMS: FPGA_SPI_LMS_SS, FPGA_SPI_MISO, FPGA_SPI_MOSI, FPGA_SPI_SCLK
I2C: I2C_SCL, I2C_SDA

### Nets
GND: C1.2 C2.2 C3.1 IC1.V30(LOGIC_RESET) IC2.1(A0) IC2.2(A1) IC2.3(A2) IC2.4(VSS) IC2.7(WP) IC3.4(VSS) IC3.7(WP) R10.1 R11.2 ; port GND
VDIO_LMS: C2.1 C3.2 IC2.8(VCC) IC3.1(A0) IC3.2(A1) IC3.3(A2) IC3.8(VCC) R1.2 R2.2 R3.1 R4.1 R5.2 R12.1 R13.1 ; port VDIO_LMS
LMS_CORE_LDO_EN: IC1.U33(CORE_LDO_EN) R5.1 ; port LMS_CORE_LDO_EN
LMS_DIQ1_D0: IC1.AG31(DIQ1_D0)
LMS_DIQ1_D1: IC1.AF30(DIQ1_D1)
LMS_DIQ1_D2: IC1.AF34(DIQ1_D2)
LMS_DIQ1_D3: IC1.AE31(DIQ1_D3)
LMS_DIQ1_D4: IC1.AD30(DIQ1_D4)
LMS_DIQ1_D5: IC1.AC29(DIQ1_D5)
LMS_DIQ1_D6: IC1.AE33(DIQ1_D6)
LMS_DIQ1_D7: IC1.AD32(DIQ1_D7)
LMS_DIQ1_D8: IC1.AC31(DIQ1_D8)
LMS_DIQ1_D9: IC1.AC33(DIQ1_D9)
LMS_DIQ1_D10: IC1.AB30(DIQ1_D10)
LMS_DIQ1_D11: IC1.AB32(DIQ1_D11)
LMS_DIQ2_D0: IC1.H30(DIQ2_D0)
LMS_DIQ2_D1: IC1.J31(DIQ2_D1)
LMS_DIQ2_D2: IC1.K30(DIQ2_D2)
LMS_DIQ2_D3: IC1.K32(DIQ2_D3)
LMS_DIQ2_D4: IC1.L31(DIQ2_D4)
LMS_DIQ2_D5: IC1.K34(DIQ2_D5)
LMS_DIQ2_D6: IC1.M30(DIQ2_D6)
LMS_DIQ2_D7: IC1.M32(DIQ2_D7)
LMS_DIQ2_D8: IC1.N31(DIQ2_D8)
LMS_DIQ2_D9: IC1.N33(DIQ2_D9)
LMS_DIQ2_D10: IC1.P30(DIQ2_D10)
LMS_DIQ2_D11: IC1.P32(DIQ2_D11)
LMS_ENABLE_IQSEL1: IC1.Y32(ENABLE_IQSEL1) ; port LMS_ENABLE_IQSEL1
LMS_ENABLE_IQSEL2: IC1.R33(ENABLE__IQSEL2) ; port LMS_ENABLE_IQSEL2
LMS_FCLK1: IC1.AA33(FCLK1) ; port LMS_FCLK1
LMS_FCLK2: IC1.R29(FCLK2) ; port LMS_FCLK2
LMS_I2C_SCL: IC1.C27(SCL) IC2.6(SCL) IC3.6(SCL) R12.2 ; port LMS_I2C.I2C_SCL
LMS_I2C_SDA: IC1.D26(SDA) IC2.5(SDA) IC3.5(SDA) R13.2 ; port LMS_I2C.I2C_SDA
LMS_MCLK1: IC1.AB34(MCLK1) ; port LMS_MCLK1
LMS_MCLK2: IC1.P34(MCLK2) ; port LMS_MCLK2
LMS_RESET: IC1.E27(RESET) R2.1 ; port LMS_RESET
LMS_RXEN: IC1.V34(RXEN) R4.2 ; port LMS_RXEN
LMS_TXEN: IC1.U29(TXEN) R3.2 ; port LMS_TXEN
LMS_TXNRX1: IC1.V32(TXNRX1) R1.1 ; port LMS_TXNRX1
LMS_TXNRX2: IC1.U31(TXNRX2) R10.2 ; port LMS_TXNRX2
RxPLL_CLK: IC1.AM24(xoscin_rx) ; port RxPLL_CLK
TxPLL_CLK: IC1.E5(xoscin_tx) ; port TxPLL_CLK
NetC1_1: C1.1 IC1.C29(SCLK) R6.1
NetIC1_D28: IC1.D28(SEN) R9.1
NetIC1_F18: IC1.F18(vr_rext) R11.1
NetIC1_F28: IC1.F28(SDO) R8.1
NetIC1_F30: IC1.F30(SDIO) R7.1
NetIC8_C8: R8.2 ; port FPGA_SPI_LMS.FPGA_SPI_MISO
NetIC8_D7: R7.2 ; port FPGA_SPI_LMS.FPGA_SPI_MOSI
NetIC8_D10: R9.2 ; port FPGA_SPI_LMS.FPGA_SPI_LMS_SS
NetIC8_E6: R6.2 ; port FPGA_SPI_LMS.FPGA_SPI_SCLK

Not connected (* = marked no-connect by the designer): IC1 AA1(adcin_ip_2)* AA3(adcin_qp_2)* AA5(rbbqn_pad_1)* AB2(rbbin_pad_1)* AB4(rbbqp_pad_1)* AB6(rbbqn_pad_2)* AC3(rbbin_pad_2)* AC5(rbbqp_pad_2)* AD2(rbbip_pad_2)* B22(tstao)* D22(tstdo<0>)* F22(tstdo<1>)* P2(tbbqn_pad_1)* R3(tbbqp_pad_1)* R5(tbbin_pad_1)* T4(tbbip_pad_1)* T6(tbbin_pad_2)* U1(tbbqn_pad_2)* U3(tbbqp_pad_2)* U5(adcin_in_1)* V2(tbbip_pad_2)* V4(adcin_ip_1)* V6(adcin_in_2)* W3(adcin_qn_1)* Y2(adcin_qp_1)* Y4(adcin_qn_2)* Y6(rbbip_pad_1)*

### Buses and harness runs
bus LMS_DIQ1_D[11..0] = port LMS_DIQ1_D[11..0]
bus LMS_DIQ2_D[11..0] = port LMS_DIQ2_D[11..0]

### Layout directives
net class CLK_PATH: RxPLL_CLK, TxPLL_CLK
net class FPGA_SPI0: (no net found under the mark)
net class LMS_I2C: LMS_I2C_SCL, LMS_I2C_SDA
net class LMS_PORT2: LMS_DIQ2_D0, LMS_DIQ2_D1, LMS_DIQ2_D2, LMS_DIQ2_D3, LMS_DIQ2_D4, LMS_DIQ2_D5, LMS_DIQ2_D6, LMS_DIQ2_D7, LMS_DIQ2_D8, LMS_DIQ2_D9, LMS_DIQ2_D10, LMS_DIQ2_D11, LMS_ENABLE_IQSEL2, LMS_FCLK2, LMS_MCLK2, LMS_TXNRX2
net class LMS_PORT1: LMS_DIQ1_D0, LMS_DIQ1_D1, LMS_DIQ1_D2, LMS_DIQ1_D3, LMS_DIQ1_D4, LMS_DIQ1_D5, LMS_DIQ1_D6, LMS_DIQ1_D7, LMS_DIQ1_D8, LMS_DIQ1_D9, LMS_DIQ1_D10, LMS_DIQ1_D11, LMS_ENABLE_IQSEL1, LMS_FCLK1, LMS_MCLK1, LMS_TXNRX1
net class LMS_MISC: LMS_CORE_LDO_EN, LMS_RESET, LMS_RXEN, LMS_TXEN

### Notes on the sheet
- NF elements on sheet: -
- Number of NF elements on sheet: 0
- LMS7002M misc
- Digital interfaces
- Baseband external IO
- (near IC1) PCB note: Make equal lenght traces for each LMS port
- LMS EEPROMs
- I2C Address: [1 0 1 0 0 0 0 RW]
- I2C Address: [1 0 1 0 1 1 1 RW]
- Project name:
- Title:
- Size:
- Date:
- A3
- Revision:
- Time:
- Sheet
- of
- File:
- (in symbol LMS7002M, part A) LMS7002M Digital; Part 1/5; PORT1; PLL CLOCK IN; MISC; SPI; PORT2; I2C; TEST PINS; 10k reference resistor; aQFN-261
- (in symbol LMS7002M, part C) LMS7002M Analogue; Part 3/5; aQFN-261

### Library data of the parts
C1 = Cap_0402: Manufacturer Part Number 1: 04023A100JAT2A; Manufacturer: AVX; Part Description: 10pF ±5% 25V C0G, NP0 Ceramic Capacitor -55°C ~ 125°C Surface Mount, MLCC 0402 (1005 Metric) 0.039" L x 0.020" W (1.00mm x 0.50mm); Capacitance Tolerance: ± 5%; Voltage Rating: 25; Ceramic Capacitor Case: 0402 [1005 Metric]; Capacitor Case Style: 0402 [1005 Metric]<!--FANDB--><div class="features-and-benefits-container"></div>; Dielectric Characteristic: C0G / NP0; SVHC: No SVHC (16-Jun-2014); Capacitance: 10; Value: 10pF, 25V; Supplier 1: Farnell; Supplier Part Number 1: 2332478RL; Product Range: -; RoHS: YES; Operating Temperature Min: -55; Operating Temperature Max: 125; Capacitance Tolerance ±: ± 5%; MSL: MSL 1 - Unlimited; Packaging: Cut Tape
C2 C3 = Cap_0402: as C118 on sheet 10_FPGA_misc; Value: 1uF, 10V; Supplier 1: Newark; Supplier Part Number 1: 490-6298-2-ND; MSL: -; RoHS: YES
IC1 = LMS7002M: Manufacturer: Lime Microsystems; Part Description: IC FPRF Transceiver LMS7002M; 261 pin aQFN; Manufacturer Part Number 1: LMS7002M; Supplier 1: Lime Microsystems; Supplier Part Number 1: LMS7002M
IC2 = 24FC64F: Manufacturer Part Number 1: 24FC64F-I/ST; Manufacturer: Microchip Technology; Part Description: IC EEPROM 512KBIT 1MHZ 8TSSOP; Format - Memory: EEPROMs - Serial; Speed: 400kHz, 1MHz; Interface: I²C, 2-Wire Serial; Memory Type: EEPROM; Memory Size: 64K (8K x 8); Voltage - Supply: 1.7 V ~ 5.5 V; Supplier 1: Digi-Key; Packaging: Tube; Supplier Device Package: 8-TSSOP; Operating Temperature: -40°C ~ 85°C; RoHS: RoHS Compliant; Category: Integrated Circuits (ICs); Package / Case: 8-TSSOP (0.173", 4.40mm Width); Supplier Part Number 1: 24FC64F-I/ST-ND
IC3 = 24FC512: Manufacturer Part Number 1: 24FC512-I/ST; Manufacturer: Microchip Technology; Part Description: IC EEPROM 512KBIT 1MHZ 8TSSOP; Speed: 400kHz, 1MHz; Memory Type: EEPROM; Memory Size: 512K (64K x 8); Voltage - Supply: 1.7 V ~ 5.5 V; Interface: I²C, 2-Wire Serial; Format - Memory: EEPROMs - Serial; Supplier 1: Digi-Key; RoHS: RoHS Compliant; Packaging: Tube; Operating Temperature: -40°C ~ 85°C; Supplier Device Package: 8-TSSOP; Category: Integrated Circuits (ICs); Package / Case: 8-TSSOP (0.173", 4.40mm Width); Supplier Part Number 1: 24FC512-I/ST-ND
R1-R5 R10 R11 = Res_0402: as R55 on sheet 10_FPGA_misc; Value: 10k, 1%; Supplier 1: Digi-Key; Supplier Part Number 1: 311-10.0KLRTR-ND; Resistance (Ohms): 10k; Packaging: Tape & Reel (TR); RoHS: RoHS Compliant; Package / Case: 0402 (1005 Metric); Tolerance: ±1%; Operating Temperature: -55°C ~ 155°C; Size / Dimension: 0.039" L x 0.020" W (1.00mm x 0.50mm); Number of Terminations: 2; Category: Resistors; Height: 0.016" (0.40mm); Supplier Device Package: 0402; Features: Moisture Resistant; Composition: Thick Film
R6-R9 = Res_0402: as R46 on sheet 08_FPGA_banks_1_2_3_4; Number of Terminations: 2; Size / Dimension: 0.039" L x 0.020" W (1.00mm x 0.50mm); Supplier Device Package: 0402 (1005 Metric); RoHS: RoHS Compliant; Supplier Part Number 1: 1276-3469-6-ND; Features: -; Packaging: Digi-Reel®; Tolerance: ±1%; Height: 0.016" (0.40mm); Category: Resistors; Composition: Thick Film; Package / Case: 0402 (1005 Metric); Supplier 1: Digi-Key; Operating Temperature: -55°C ~ 155°C; Value: 49.9R, 1%
R12 R13 = Res_0402: Manufacturer: Stackpole Electronics Inc; Manufacturer Part Number 1: RMCF0402FT2K20; Part Description: RES SMD 2.2K OHM 1% 1/16W 0402; Resistance (Ohms): 2.2k; Temperature Coefficient: ±100ppm/°C; Power (Watts): 0.063W, 1/16W; Value: 2k2, 1%; Supplier 1: Digi-Key; Supplier Part Number 1: RMCF0402FT2K20CT-ND; Supplier Device Package: 0402; Package / Case: 0402 (1005 Metric); Size / Dimension: 0.039" L x 0.020" W (1.00mm x 0.50mm); Operating Temperature: -55°C ~ 155°C; Composition: Thick Film; Category: Resistors; Features: -; Height: 0.016" (0.40mm); RoHS: RoHS Compliant; Number of Terminations: 2; Packaging: Cut Tape (CT); Tolerance: ±1%